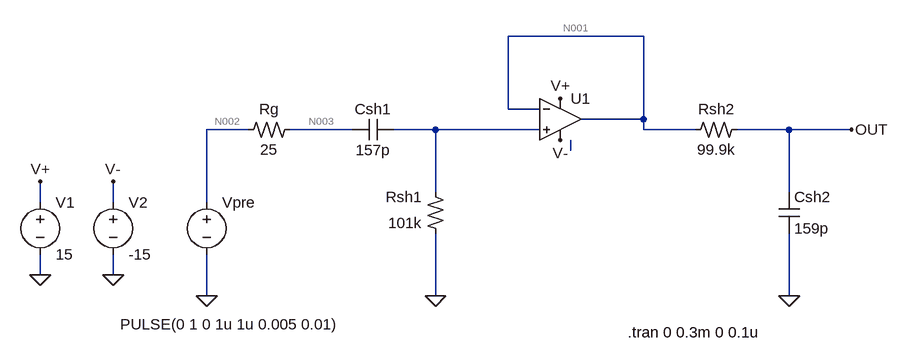
[diagram p0: schematic Shaper.asc]
Shaper.asc, the LTspice schematic file:
Version 4
SHEET 1 964 680
WIRE 576 -160 368 -160
WIRE 368 -48 368 -160
WIRE 416 -48 368 -48
WIRE 576 -32 576 -160
WIRE 576 -32 480 -32
WIRE -32 -16 -96 -16
WIRE 128 -16 32 -16
WIRE 256 -16 192 -16
WIRE 416 -16 256 -16
WIRE 576 -16 576 -32
WIRE 656 -16 576 -16
WIRE 800 -16 720 -16
WIRE 896 -16 800 -16
WIRE 464 16 464 0
WIRE 256 80 256 -16
WIRE 800 80 800 -16
WIRE -352 96 -352 64
WIRE -240 96 -240 64
WIRE -96 96 -96 -16
WIRE -352 208 -352 176
WIRE -240 208 -240 176
WIRE -96 240 -96 176
WIRE 256 240 256 144
WIRE 800 240 800 144
FLAG -352 208 0
FLAG -240 208 0
FLAG -352 64 V+
FLAG -240 64 V-
FLAG 448 0 V-
FLAG 448 -64 V+
FLAG -96 240 0
FLAG 256 240 0
FLAG 800 240 0
FLAG 896 -16 OUT
SYMBOL voltage -352 80 R0
WINDOW 123 24 126 Left 2
WINDOW 39 24 111 Left 2
SYMATTR InstName V1
SYMATTR Value 15
SYMBOL voltage -240 80 R0
WINDOW 123 24 126 Left 2
WINDOW 39 24 111 Left 2
SYMATTR InstName V2
SYMATTR Value -15
SYMBOL Opamps/UniversalOpamp2 448 -32 R0
SYMATTR InstName U1
SYMBOL res2 32 -32 R90
WINDOW 0 0 32 VBottom 2
WINDOW 3 31 32 VTop 2
SYMATTR InstName Rg
SYMATTR Value 25
SYMBOL voltage -96 80 R0
WINDOW 3 -133 204 Left 2
WINDOW 123 0 0 Left 0
WINDOW 39 0 0 Left 0
SYMATTR Value PULSE(0 1 0 1u 1u 0.005 0.01)
SYMATTR InstName Vpre
SYMBOL cap 192 -32 R90
WINDOW 0 0 32 VBottom 2
WINDOW 3 32 32 VTop 2
SYMATTR InstName Csh1
SYMATTR Value 157p
SYMBOL res2 272 144 R180
WINDOW 0 36 56 Left 2
WINDOW 3 36 16 Left 2
SYMATTR InstName Rsh1
SYMATTR Value 101k
SYMBOL res2 720 -32 R90
WINDOW 0 0 32 VBottom 2
WINDOW 3 31 32 VTop 2
SYMATTR InstName Rsh2
SYMATTR Value 99.9k
SYMBOL cap 784 80 R0
SYMATTR InstName Csh2
SYMATTR Value 159p
TEXT 552 296 Left 2 !.tran 0 0.3m 0 0.1u

The netlist it stands for:
* Shaper.asc
V1 V+ 0 15
V2 V- 0 -15
XU1 N004 N001 V+ V- N001 level.2 Avol=1Meg GBW=10Meg Slew=10Meg ilimit=25m rail=0 Vos=0 phimargin=45 en=0 enk=0 in=0 ink=0 Rin=500Meg  ; pins IN+ IN- V+ V- OUT
Rg N003 N002 25
Vpre N002 0 PULSE(0 1 0 1u 1u 0.005 0.01)
Csh1 N004 N003 157p
Rsh1 0 N004 101k
Rsh2 OUT N001 99.9k
Csh2 OUT 0 159p
.tran 0 0.3m 0 0.1u
.lib UniversalOpamps2.sub
.backanno
.end

* Results of the author's LTspice run, read from the files saved beside the schematic
* Operating Point, zero values left out:
*   V(v+) = 15 V
*   V(v-) = -15 V
*   I(V2) = 1.498 mA
*   I(V1) = -1.498 mA
*   Ix(u1:3) = 1.498 mA
*   Ix(u1:4) = -1.498 mA
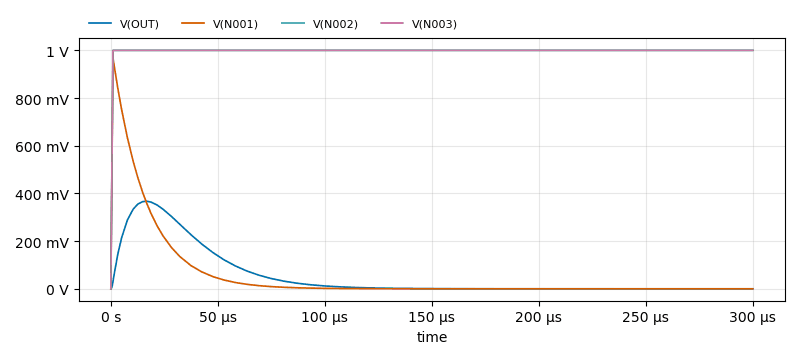
[diagram p1: Transient Analysis of Shaper.asc, plotted from the saved traces]
* Transient Analysis, 1 run:
*   V(OUT): min 0 V, max 367.3 mV, average 52.83 mV, rms 114.9 mV, last 120.3 nV
*   V(N001): min 0 V, max 963.7 mV, average 53 mV, rms 161.4 mV, last 0 V
*   V(N002): min 0 V, max 1 V, average 998.3 mV, rms 998.9 mV, last 1 V
*   V(N003): min 0 V, max 1 V, average 998.3 mV, rms 998.9 mV, last 1 V